# Altium schematic sheet 02-MCU.SchDoc: ECE453 Power
size A; Date: 4/25/2017; ApprovedBy: JSK; CheckedBy: JSK; Author: JSK; CompanyName: University of Wisconsin; DrawnBy: JSK; Engineer: JSK; Organization: ECE 315; Address1: College of Engineering; Address2: 1415 Engineering Drive; Address3: Madison, WI 53706; Address4: ECE 453 Fall 2022; Revision: A; SheetNumber: 2; SheetTotal: 2; AssemblyNumber: ECE453-F22-01
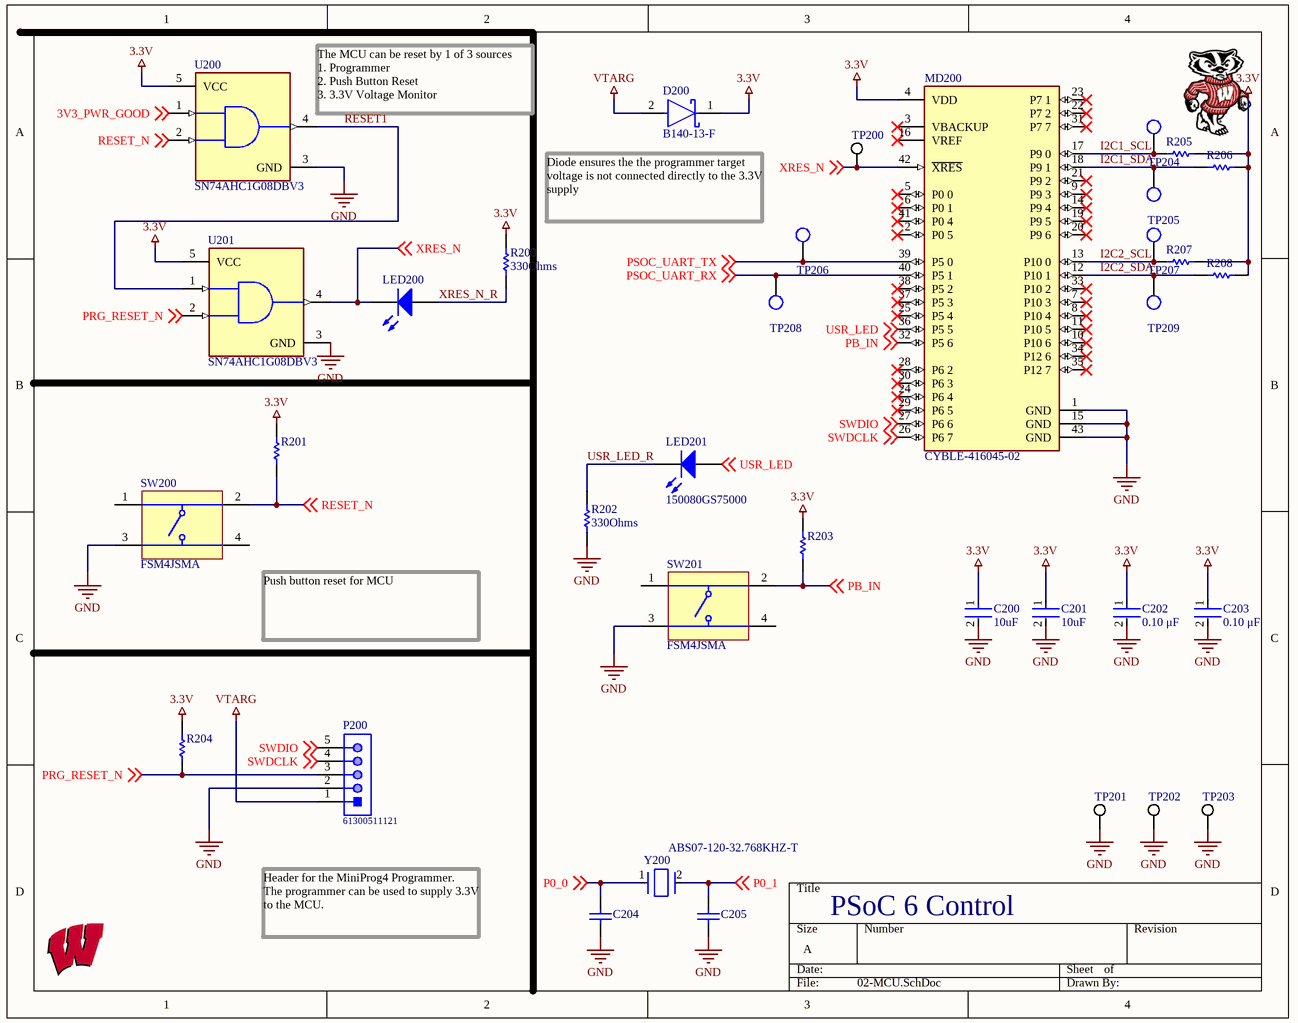
[diagram p0: 02-MCU.SchDoc]

## Parts
C200  value 10uF  [FP-C0805C-DG-MFG]  (hidden comment: C0805C106K8PACTU)
C201  value 10uF  [FP-C0805C-DG-MFG]  (hidden comment: C0805C106K8PACTU)
C202  value 0.10 μF  [FP-C0805C-DN-MFG]  (hidden comment: C0805C104K5RACTU)
C203  value 0.10 μF  [FP-C0805C-DN-MFG]  (hidden comment: C0805C104K5RACTU)
C204  08055A6R0CAT2A  [CAPC2013X94X50LL20T25]  (value not drawn)
C205  08055A6R0CAT2A  [CAPC2013X94X50LL20T25]  (value not drawn)
D200  B140-13-F  [FP-SMA-MFG]
LED200  150080RS75000  [0805_A]  (value not drawn)
LED201  150080GS75000  [0805_A]
MD200  CYBLE-416045-02  [FP-CYBLE-416045-02-MFG]
P200  61300511121  [61300511121]
R200  Resistance: 330Ohms  [RESC2013X60X35LL10T20]  (hidden comment: RC0805FR-07330RL)
R201  RC0805FR-0710KL  [RESC2013X60X35NL10T20]  (value not drawn)
R202  Resistance: 330Ohms  [RESC2013X60X35LL10T20]  (hidden comment: RC0805FR-07330RL)
R203  RC0805FR-0710KL  [RESC2013X60X35NL10T20]  (value not drawn)
R204  RC0805FR-0710KL  [RESC2013X60X35NL10T20]  (value not drawn)
R205  RC0805FR-0710KL  [RESC2013X60X35NL10T20]  (value not drawn)
R206  RC0805FR-0710KL  [RESC2013X60X35NL10T20]  (value not drawn)
R207  RC0805FR-0710KL  [RESC2013X60X35NL10T20]  (value not drawn)
R208  RC0805FR-0710KL  [RESC2013X60X35NL10T20]  (value not drawn)
SW200  FSM4JSMA  [TECO-FSM4JSMA_V]
SW201  FSM4JSMA  [TECO-FSM4JSMA_V]
TP200  5019  [KSTN-5019_V]  (value not drawn)
TP201  5019  [KSTN-5019_V]  (value not drawn)
TP202  5019  [KSTN-5019_V]  (value not drawn)
TP203  5019  [KSTN-5019_V]  (value not drawn)
TP204  TP_1206  [TP-SMC-1206]  (value not drawn)
TP205  TP_1206  [TP-SMC-1206]  (value not drawn)
TP206  TP_1206  [TP-SMC-1206]  (value not drawn)
TP207  TP_1206  [TP-SMC-1206]  (value not drawn)
TP208  TP_1206  [TP-SMC-1206]  (value not drawn)
TP209  TP_1206  [TP-SMC-1206]  (value not drawn)
U200  SN74AHC1G08DBV3  [FP-DBV0005A-IPC_C]
U201  SN74AHC1G08DBV3  [FP-DBV0005A-IPC_C]
Y200  ABS07-120-32.768KHZ-T  [FP-ABS07-120-MFG]

## Nets
3.3V: C200.1 C201.1 C202.1 C203.1 D200.1(C) MD200.4(VDD) R200.2 R201.2 R203.2 R204.2 R205.1 R206.1 R207.1 R208.1 U200.5(VCC) U201.5(VCC)
GND: C200.2 C201.2 C202.2 C203.2 C204.1 C205.1 MD200.1(GND) MD200.15(GND) MD200.43(GND) P200.2 R202.1 SW200.3 SW201.3 TP201.1 TP202.1 TP203.1 U200.3(GND) U201.3(GND)
VTARG: D200.2(A) P200.1
3V3_PWR_GOOD: U200.1(A) ; off-sheet 3V3_PWR_GOOD
I2C1_SCL: MD200.17(P9_0) R205.2 TP204.1
I2C1_SDA: MD200.18(P9_1) R206.2 TP205.1
I2C2_SCL: MD200.13(P10_0) R207.2 TP207.1
I2C2_SDA: MD200.12(P10_1) R208.2 TP209.1
P0_0: C204.2 Y200.1 ; off-sheet P0_0
P0_1: C205.2 Y200.2 ; off-sheet P0_1
PB_IN: MD200.32(P5_6) R203.1 SW201.2 ; off-sheet PB_IN
PRG_RESET_N: P200.3 R204.1 U201.2(B) ; off-sheet PRG_RESET_N
PSOC_UART_RX: MD200.40(P5_1) TP208.1 ; off-sheet PSOC_UART_RX
PSOC_UART_TX: MD200.39(P5_0) TP206.1 ; off-sheet PSOC_UART_TX
RESET1: U200.4(Y) U201.1(A)
RESET_N: R201.1 SW200.2 U200.2(B) ; off-sheet RESET_N
SWDCLK: MD200.26(P6_7) P200.4 ; off-sheet SWDCLK
SWDIO: MD200.27(P6_6) P200.5 ; off-sheet SWDIO
USR_LED: LED201.2(A) MD200.36(P5_5) ; off-sheet USR_LED
USR_LED_R: LED201.1(K) R202.2
XRES_N: LED200.1(K) MD200.42(~{XRES}) TP200.1 U201.4(Y) ; off-sheet XRES_N
XRES_N_R: LED200.2(A) R200.1

Not connected (* = marked no-connect by the designer): MD200 2(P0_5)* 3(VBACKUP)* 5(P0_0)* 6(P0_1)* 7(P10_3)* 8(P10_4)* 9(P9_3)* 10(P10_6)* 11(P10_5)* 14(P9_4)* 16(VREF)* 19(P9_5)* 20(P9_6)* 21(P9_2)* 22(P7_2)* 23(P7_1)* 24(P6_4)* 25(P5_4)* 28(P6_2)* 29(P6_5)* 30(P6_3)* 31(P7_7)* 33(P10_2)* 34(P12_6)* 35(P12_7)* 37(P5_3)* 38(P5_2)* 41(P0_4)*; SW200 1 4; SW201 1 4

## Notes on the sheet
- (near U200) The MCU can be reset by 1 of 3 sources
  1. Programmer
  2. Push Button Reset
  3. 3.3V Voltage Monitor
- Diode ensures the the programmer target voltage is not connected directly to the 3.3V supply
- (near SW200) Push button reset for MCU
- Header for the MiniProg4 Programmer.  The programmer can be used to supply 3.3V to the MCU.
- PSoC 6 Control

## Library data of the parts
C200 C201 = CMP-2007-03243-2: CAP CER 10UF 10V X5R 0805; Manufacturer: Kemet; 3DS Part Number: 220-00001; Tolerance: 10%; Temperature Coefficient: 15%; Material: Ceramic; Device Class L2: Capacitors; Device Class L1: Passive Components; ComponentLink2URL: https://content.kemet.com/datasheets/KEM_C1006_X5R_SMD.pdf; Height: 1.4mm; Lead Free: Yes; Manufacturer Part Number: C0805C106K8PACTU; Digikey Description: CAP CER 10UF 10V X5R 0805; Octopart: https://octopart.com/c0805c106k8pactu-kemet-98697; Capacitance: 10uF; Temperature Range Low: -55°C; Temperature: -55°C to +85°C; Automotive: No; Mouser Description: CAP CER 10UF 10V X5R 0805; Ipc Land Pattern Name: CAPC200125X125; Temperature Range High: +85°C; Voltage: 10V; RoHS: TRUE; Device Class L3: Ceramic Capacitors; ComponentLink2Description: Datasheet; Voltage Rating: 10V; Package: C0805C-DG; Temperature Characteristic: X5R; Category: Cap
C202 C203 = CMP-2007-00279-2: CAP CER 0.1UF 50V X7R 0805; Manufacturer: KEMET; Tolerance: 0.1; Temperature Coefficient: 30ppm/°C; Material: Ceramic; Manufacturer Part Number: C0805C104K5RACTU; Device Class L2: Capacitors; Temperature Range Low: -55°C; Voltage Rating: 50 V; Digikey Description: CAP CER 0.1UF 50V X7R 0805; Category: Cap; ComponentLink2Description: Datasheet; Octopart: https://octopart.com/c0805c104k5ractu-kemet-143926; RoHS: TRUE; ComponentLink2URL: https://content.kemet.com/datasheets/KEM_C1003_C0G_SMD.pdf; Temperature Characteristic: X7R; Temperature: -55°C to +125°C; Height: 0.88mm; Temperature Range High: +125°C; Device Class L1: Passive Components; Automotive: No; Lead Free: Yes; Ipc Land Pattern Name: CAPC200125X78; Device Class L3: Ceramic Capacitors; Mouser Description: Cap Ceramic 0.1uF 50V X7R 10% SMD 2.0 x 1.2 mm 125 C Paper T/R; Capacitance: 0.10 μF; Package: C0805C-DN
C204 C205 = CMP-2007-04344-1: Manufacturer: AVX Interconnect / Elco; Part Number: 08055A6R0CAT2A
D200 = CMP-2000-05096-2: DIODE SCHOTTKY 40V 1A SMA; Element Configuration: Single; Capacitance: 110pF; Forward Voltage: 500mV; Max Forward Surge Current (Ifsm): 30A; Max Reverse Current: 500uA; Polarity: Standard; Package Quantity: 5000; Average Rectified Current: 1A; Height: 2.1mm; Max Operating Temperature: 150°C; Radiation Hardening: No; Mount: Surface Mount; REACH SVHC: No SVHC; Contact Plating: Tin; Width: 2.92mm; RoHS Compliant: Yes; Max Repetitive Reverse Voltage (Vrrm): 40V; Current Rating: 1A; Termination: SMD/SMT; Number of Pins: 2; Max Reverse Voltage (DC): 40V; Series: B140; Length: 4.6mm; Forward Current: 1A; Voltage Rating (DC): 40V; Lead Free: Lead Free; Weight: 0.004233oz; Output Current: 1A; Case/Package: SMA; Min Operating Temperature: -65°C; Packaging: Cut Tape; Peak Non-Repetitive Surge Current: 30A
LED200 = CMP-1426-00011-1: SMD mono-color Chip LED, WL-SMCW, Red; Manufacturer: Wuerth Elektronik; Color: Red; PartNumber: 150080RS75000; PackageReference: 0805_A; ComponentLink2Description: Datasheet; ComponentLink1URL: http://www.we-online.com; ComponentLink1Description: Manufacturer URL; ComponentLink2URL: http://katalog.we-online.com/led/datasheet/150080RS75000.pdf
LED201 = CMP-1426-00007-1: SMD mono-color Chip LED, WL-SMCW, Green; Manufacturer: Wuerth Elektronik; PackageReference: 0805_A; Color: Green; PartNumber: 150080GS75000; ComponentLink2URL: http://katalog.we-online.com/led/datasheet/150080GS75000.pdf; ComponentLink1URL: http://www.we-online.com; ComponentLink1Description: Manufacturer URL; ComponentLink2Description: Datasheet
MD200 = CMP-12964-000002-1: RF TXRX MOD BLUETOOTH TRACE ANT; Manufacturer: Cypress Semiconductor; Number Of Gpio: 36; Number Of Adc Channels: 1; Max Supply Voltage: 3.6V; Min Supply Voltage: 1.71V; Data Rate: 2Mbits/s; Receiving Current: 6.7mA; Max Frequency: 2.5GHz; Bandwidth: 100MHz; Transmitting Current: 5.7mA; Interface: I2C,SPI,UART,I2S,Other; Octopart: https://octopart.com/cyble-416045-02-cypress+semiconductor-96386825; Lead Free: Yes; RoHS: TRUE; Device Class L3: Transceivers; Category: UNK; Package: 0; Device Class L2: RF Semiconductors and Devices; Automotive: No; ComponentLink2URL: https://www.cypress.com/file/428336/download; Temperature Range Low: -40°C; Height: 2mm; Device Class L1: Integrated Circuits (ICs); Manufacturer Part Number: CYBLE-416045-02; ComponentLink2Description: Datasheet; Digikey Description: RF TXRX MOD BLUETOOTH TRACE ANT; Temperature: -40°C to +85°C; Temperature Range High: +85°C
P200 = CMP-1502-01068-1: THT Vertical Pin Header WR-PHD, Pitch 2.54 mm, Single Row, 5 pins; Manufacturer: Wurth Elektronik; Pin Number: 5; Contact Resistance: 20mOhm; Working Voltage: 250VAC; Pitch: 2.54mm; Withstanding Voltage: 500VAC; Rated Current: 3A; Gender: Male; Datasheet URL: https://katalog.we-online.de/em/datasheet/6130xx11121.pdf; Orientation: Vertical; Mounting Technology: THT; Row Number: Single; Package Reference: 61300511121; Publisher: WurthElektronik; Part Number: 61300511121; Packaging: Bag; Manufacturer URL: http://www.we-online.de; Operating Temperature: -40to105degC
R200 R202 = CMP-2000-06960-1: Chip Resistor, 330 Ohm, +/- 1%, 125 mW, -55 to 155 degC, 0805 (2012 Metric), RoHS, Tape and Reel; Manufacturer: Yageo; Voltage Rating: 150V; Temperature Coefficient: 100PPM/C; Power Rating: 125mW(1/8W); Datasheet Version: Rev. 7, 05/2017; Termination Style: SMD/SMT; Case Code - mm: 2012; Package Description: 2-Pin Surface Mounted Device, Body 2 x 1.25 mm; Operating Temperature Range: -55Cto+155C; Case Code - in: 0805; Packaging: Reel; Tolerance: 1%; Package Reference: 0805; Mounting Technology: SurfaceMount; Product: ThickFilmResistorsGeneralPurpose; Series: RC; Manufacturer URL: http://www.yageo.com/; Datasheet URL: http://www.yageo.com/documents/recent/PYu-RC_Group_51_RoHS_L_7.pdf
R201 R203-R208 = CMP-1659-00013-4: Chip Resistor, 10 KOhm, +/- 1%, 0.125 W, -55 to 155 degC, 0805 (2012 Metric), RoHS, Tape and Reel; Manufacturer: Yageo; Voltage Rating: 150 V; Mount: Surface Mount; ComponentLink1Description: Manufacturer URL; ComponentLink2URL: http://www.yageo.com/documents/recent/PYu-RC_Group_51_RoHS_L_04.pdf; Pins: 2; Length: 2 mm; Min Operating Temperature: -55 degC; Height: 0.5 mm; Mounting Technology: Surface Mount; RoHSCompliant: true; REACH SVHC: No SVHC; ComponentLink1URL: http://www.yageo.com/; Max Operating Temperature: 155 degC; PackageReference: 0805; DatasheetVersion: Rev. 4, 02/2016; Package Quantity: 5000; Packaging: Tape and Reel; ComponentLink2Description: Datasheet; PackageDescription: 2-Pin Surface Mounted Device, Body 2 x 1.25 mm
SW200 SW201 = CMP-2000-05602-2: Swicth, SPST, 24 V, -35 to 85 degC, 4-Pin SMD, RoHS, Tape and Reel; Manufacturer: TE Connectivity; Switch Travel: 0.25mm; Mechanical Life: 100000Cycles; Contact Current Rating: 50mA; Operating Force: 1.57N; Actuator Material: Polyamide; Contact Resistance: 100mOhm; Voltage Rating: 24V; Illumination Type: Illuminated; Actuator Length: 0.055inch; Max Voltage Rating (DC): 12V; Case\/Package: SMD/SMT; Orientation: Straight; Datasheet URL: http://www.te.com/commerce/DocumentDelivery/DDEController?Action=showdoc&DocId=Customer+Drawing%7F2-1437565-7%7FV%7Fpdf%7FEnglish%7FENG_CD_2-1437565-7_V.pdf%7F4-1437565-2; Min Operating Temperature: -35degC; Packaging: LoosePiece; Termination: GullWing; Throw Configuration: SPST; Package Description: 4-Pin Surface Mount Device, Body 6 x 6 mm, Pitch 4.5 mm; Mounting Technology: SurfaceMount; Contact Plating: Silver; Datasheet Version: Rev. V, 02/2015; RoHSCompliant: true; Max Operating Temperature: 85degC; Length: 6mm; Voltage Rating (DC): 24V; Electrical Life: 100000Cycles; Current Rating: 50mA; Package Quantity: 750; Mount: SurfaceMount; Package Reference: FSM4JSMA; Manufacturer URL: http://www.te.com/; Width: 6mm; REACH SVHC: Unknown; Contact Material: CopperAlloy
TP200-TP203 = CMP-1672-00008-1: Test Point, 1 Position SMD, RoHS, Tape and Reel; ComponentLink1Description: Manufacturer URL; Package Quantity: 1000; DatasheetVersion: 03/2014; Packaging: Tape and Reel; ComponentLink2URL: http://www.keyelco.com/product-pdf.cfm?p=1357; ComponentLink1URL: http://www.keyelco.com/; Mount: Surface Mount; Contact Plating: Silver; PackageDescription: 1-Pin Surface Mount Device, Body 3.81 x 2.03 mm; Pins: 1; RoHSCompliant: True; Mounting Technology: Surface Mount; ComponentLink2Description: Datasheet; PackageReference: 5019
TP204-TP209 = TP_1206: Test Point SMD 1206; Manufacturer: TE Connectivity (Tyco Electronics); Manufacturer Part Number: 1625854-1; Resistance Value: 0 Ohm; Temperature Coefficient: N/R; Supplier: Digi-Key; Stock 1: 31937; Pricing 1: 1=0.28, 10=0.261, 25=0.224, 50=0.1902, 100=0.1828, 250=0.1641, 500=0.1567, 1000=0.1306 (USD); Case Size: 1206; Dimension: 3.2 x 1.6 x 1.25mm; Family: RC; Mounting: Surface Mount; Operating Temperature: -55 to 125 C; Part No: 1625854-1; RoHS: Yes; Packaging: Tape and Reel; Termination Style: N/R; Terminal Pitch: N/R; Power Rating: N/R; Tolerance: N/R; ComponentLink1URL: https://datasheet.ciiva.com/6439/eng-ds-1773266-a-6439169.pdf; ComponentLink1Description: https://datasheet.ciiva.com/6439/eng-ds-1773266-a-6439169.pdf; ComponentLink2URL: https://datasheet.ciiva.com/30136/1773266-a-30136341.pdf; ComponentLink2Description: https://datasheet.ciiva.com/30136/1773266-a-30136341.pdf; ComponentLink3URL: https://datasheet.ciiva.com/6439/eng-ds-1773266-a-6439080.pdf; ComponentLink3Description: https://datasheet.ciiva.com/6439/eng-ds-1773266-a-6439080.pdf; ComponentLink4URL: https://datasheet.ciiva.com/6439/eng-ds-1773266-a-6439081.pdf; ComponentLink4Description: https://datasheet.ciiva.com/6439/eng-ds-1773266-a-6439081.pdf; ComponentLink5URL: https://datasheet.ciiva.com/6439/eng-ds-1773266-a-6439083.pdf; ComponentLink5Description: https://datasheet.ciiva.com/6439/eng-ds-1773266-a-6439083.pdf; Supplier Part Number: A106143CT-ND
U200 U201 = CMP-04903-000082-1: IC GATE AND 1CH 2-INP SOT23-5; Logic Function: AND GATE; RoHS Compliant: Yes
Y200 = CMP-2000-07587-2: CRYSTAL 32.7680KHZ 6PF SMD; Frequency Tolerance: 20ppm; Series Resistance: 60kR; ESR (Equivalent Series Resistance): 55kR; Depth: 1.5mm; Width: 0.061inch; Number of Pins: 2; Max Operating Temperature: 85°C; Length: 3.2mm; Case/Package: SMD/SMT; Series: ABS07; Lead Free: Lead Free; Min Operating Temperature: -40°C; Load Capacitance: 6pF; Packaging: Tape and Reel; Height: 0.035inch; Radiation Hardening: No; Tolerance: 20ppm; Operating Frequency: 32.768 kHz; Termination: SMD/SMT; REACH SVHC: No SVHC; RoHS Compliant: Yes; Frequency: 32.768kHz; Package Quantity: 3000; Mount: Surface Mount